# EAGLE design AV-DC (EAGLE 9.6.2)
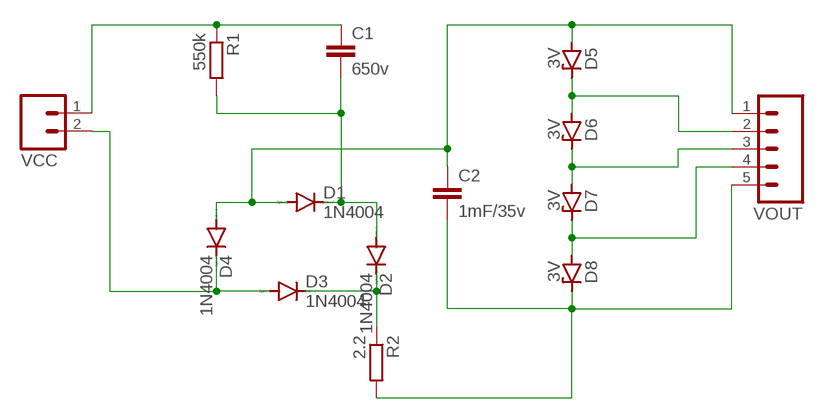
[diagram p0: schematic, sheet 1]

## Parts
C1  650v  C5/3  [C5B3]
C2  1mF/35v  C2.5/2  [C2.5-2]
D1  1N4004  [DO41-10]
D2  1N4004  [DO41-10]
D3  1N4004  [DO41-10]
D4  1N4004  [DO41-10]
D5  3V  ZENER-DIODEDO41Z10  [DO41Z10]
D6  3V  ZENER-DIODEDO41Z10  [DO41Z10]
D7  3V  ZENER-DIODEDO41Z10  [DO41Z10]
D8  3V  ZENER-DIODEDO41Z10  [DO41Z10]
R1  550k  R-EU_0207/10  [0207/10]
R2  2.2  R-EU_0207/10  [0207/10]
VCC  M02  [02P]
VOUT  M05  [05P]

## Nets
N$1: C1.1 R1.1 VCC.1
N$2: C1.2 D1.C D2.A R1.2
N$3: C2.1 D1.A D4.A D5.A VOUT.1
N$5: D2.C D3.C R2.1
N$6: D3.A D4.C VCC.2
N$8: D5.C D6.A VOUT.2
N$9: D6.C D7.A VOUT.3
N$10: D7.C D8.A VOUT.4
N$11: C2.2 D8.C R2.2 VOUT.5

## Library data of the parts
C1 C2 = capacitor-wima:C: CAPACITOR naming: grid - package width
D1-D4 = diode:1N4004: DIODE general purpose rectifier, 1 A
D5-D8 = diode:ZENER-DIODE: Z-Diode
R1 R2 = rcl:R-EU_: RESISTOR, European symbol; SPICEPREFIX: R
VCC = con-amp-quick:M02: AMP QUICK CONNECTOR; OC_FARNELL: unknown; OC_NEWARK: unknown
VOUT = con-amp-quick:M05: AMP QUICK CONNECTOR; OC_FARNELL: unknown; OC_NEWARK: unknown

## Net classes
0 default: width 0.762 mm, drill 0.762 mm, clearance 0.762 mm

## Board
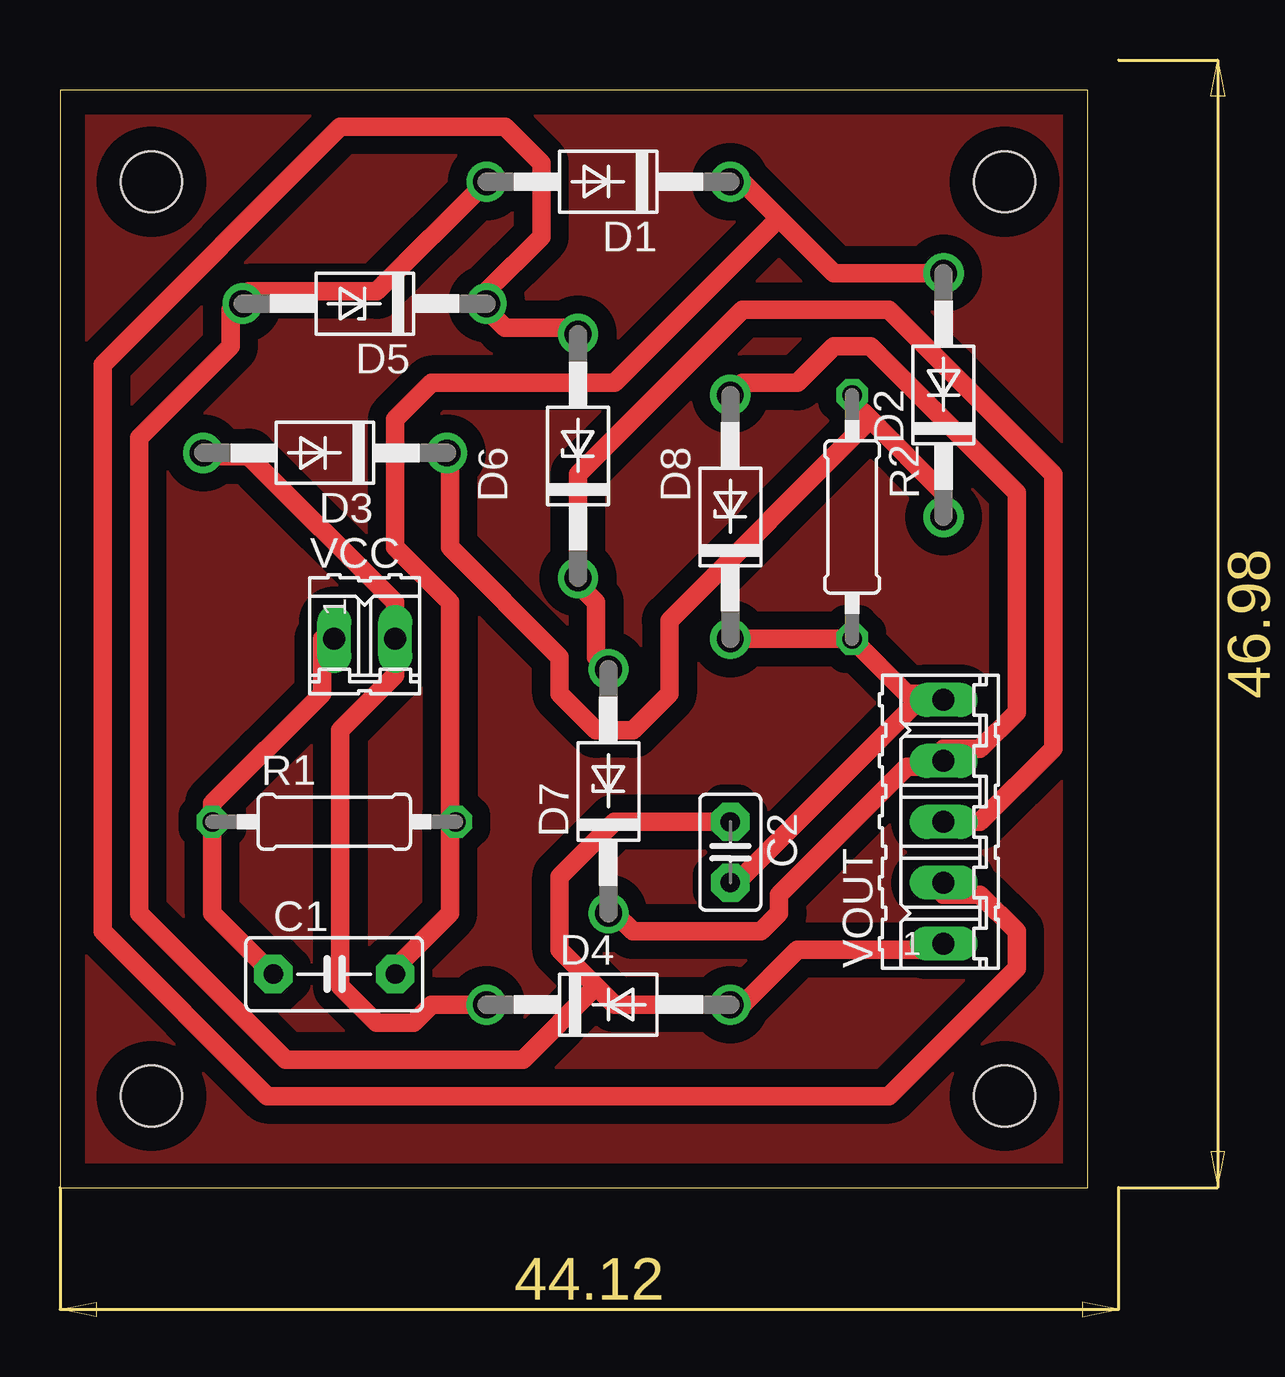
[diagram p1: board, top side]

Size 42.85 x 45.71 mm. Coordinates in mm from the lower left corner, seen from the top.
Outline: 0,0 42.85,0 42.85,45.71 0,45.71 0,0
Copper layers (1*16): Top 0.035mm / dielectric 1.5mm / Bottom 0.035mm
Design rules "default": minimum track width 6mil, minimum drill 0.35mm, track to track 6mil, track to pad 6mil, pad to pad 6mil, via to via 6mil, smd to smd 6mil, copper to edge 40mil, drill to drill 6mil, minimum pad ring 10mil, minimum via ring 8mil, stop-mask expansion 4mil, vias tented up to drill 0mil, thermal gap 10mil
Holes 2.54 mm at 3.81,41.91 39.37,41.91 39.37,3.81 3.81,3.81

### Footprints (pad centres in the part's own frame; a part is rotated, then mirrored left to right if it is on the bottom)
C5B3 = drill 0.813 pad 1.6 octagon: 1 -2.54,0; 2 2.54,0
C2.5-2 = drill 0.813 pad 1.6 octagon: 1 -1.27,0; 2 1.27,0
DO41-10 = drill 1.118: A 5.08,0; C -5.08,0
DO41Z10 = drill 1.118: A 5.08,0; C -5.08,0
0207/10 = drill 0.813 octagon: 1 -5.08,0; 2 5.08,0
02P = drill 0.914 long: 1 -1.27,0; 2 1.27,0
05P = drill 0.914 long: 1 -5.08,0; 2 -2.54,0; 3 0,0; 4 2.54,0; 5 5.08,0

### Placement (x,y rotation side)
C1  11.43,8.89 0 top
C2  27.94,13.97 270 top
D1  22.86,41.91 180 top
D2  36.83,33.02 90 top
D3  11.05,30.61 180 top
D4  22.86,7.62 0 top
D5  12.7,36.83 180 top
D6  21.59,30.48 90 top
D7  22.86,16.51 90 top
D8  27.94,27.94 90 top
R1  11.43,15.24 0 top
R2  33.02,27.94 270 top
VCC  12.7,22.86 0 top
VOUT  36.83,15.24 90 top

### Tracks (layer width: path | path; a pad name or v marks a point on that pad's centre or on a via)
GND
  pour Top (isolate 0.762): 0,45.72 43.18,45.72 43.18,0 0,0
N$1
  Top 0.762: C1.1 6.35,11.43 R1.1 6.35,16 10.92,20.57 10.92,22.86 VCC.1
N$2
  Top 0.762: 16.26,15.24 16.26,11.43 13.97,9.14 C1.2 | D2.A 32.26,38.1 29.97,40.39 | 29.97,40.39 28.45,41.91 D1.C | 16.26,15.24 16.26,24.38 13.97,26.67 13.97,32 15.49,33.53 23.11,33.53 29.97,40.39 | 16.26,15.24 R1.2
N$3
  Top 0.762: D1.A 13.21,37.34 7.87,37.34 D5.A 7.11,36.58 7.11,35.05 3.3,31.24 3.3,11.43 9.4,5.33 19.3,5.33 22.35,8.38 | VOUT.1 36.83,9.91 30.73,9.91 28.45,7.62 D4.A 23.11,7.62 22.35,8.38 | C2.1 23.11,15.24 20.83,12.95 20.83,9.91 22.35,8.38
N$5
  Top 0.762: 33.78,32 36.83,28.96 D2.C | 33.78,32 33.02,32.77 R2.1 | 33.78,32 25.4,23.62 25.4,20.57 23.88,19.05 22.35,19.05 20.83,20.57 20.83,22.1 16.26,26.67 16.26,30.48 D3.C
N$6
  Top 0.762: D3.A 6.35,30.48 7.87,30.48 13.97,24.38 VCC.2 13.97,21.34 11.68,19.05 11.68,8.38 13.21,6.86 14.73,6.86 15.49,7.62 D4.C
N$8
  Top 0.762: VOUT.2 36.83,12.19 38.35,12.19 39.88,10.67 39.88,9.14 34.54,3.81 8.64,3.81 1.78,10.67 1.78,34.29 11.68,44.2 18.54,44.2 20.07,42.67 20.07,39.62 17.78,37.34 D5.C 17.78,36.58 18.54,35.81 21.59,35.81 D6.A
N$9
  Top 0.762: VOUT.3 38.35,15.24 41.4,18.29 41.4,29.72 34.54,36.58 28.45,36.58 21.59,29.72 D6.C 21.59,25.15 22.35,24.38 22.35,22.1 D7.A
N$10
  Top 0.762: D7.C 23.11,11.43 23.88,10.67 29.21,10.67 29.97,11.43 29.97,12.19 35.31,17.53 36.83,17.53 VOUT.4 36.83,18.29 38.35,18.29 39.88,19.81 39.88,28.96 33.78,35.05 32.26,35.05 30.73,33.53 28.45,33.53 D8.A
N$11
  Top 0.762: D8.C R2.2 35.31,20.57 36.07,20.57 | 36.07,20.57 36.83,20.57 VOUT.5 36.07,20.57 | 36.07,20.57 28.45,12.95 C2.2